# Altium schematic sheet MainBoard_V100_PSU_DET.SchDoc
size A4; SheetNumber: 5; SheetTotal: 22; Title_: Detector Power Supply
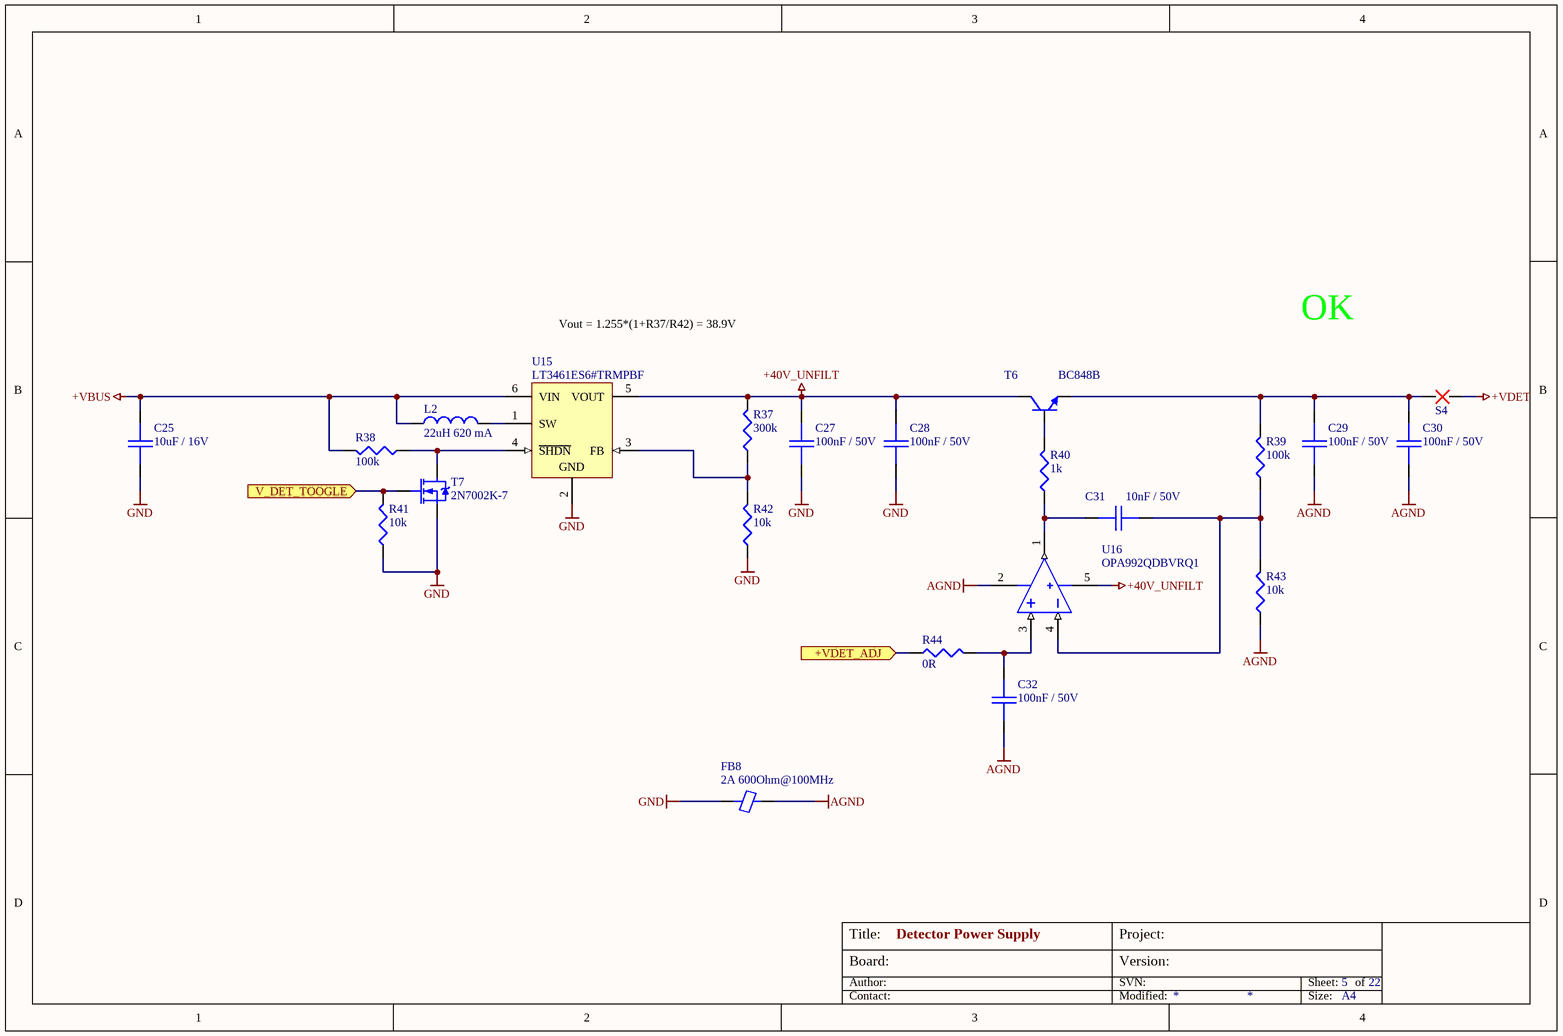
[diagram p0: MainBoard_V100_PSU_DET.SchDoc]

## Parts
C25  10uF / 16V  [0805_C]
C27  100nF / 50V  [0805_C]
C28  100nF / 50V  [0805_C]
C29  100nF / 50V  [0805_C]
C30  100nF / 50V  [0805_C]
C31  10nF / 50V  [0805_C]
C32  100nF / 50V  [0805_C]
FB8  2A 600Ohm@100MHz  [0805_FB]
L2  22uH 620 mA  [1210]
R37  300k  [0805]
R38  100k  [0805]
R39  100k  [0805]
R40  1k  [0805]
R41  10k  [0805]
R42  10k  [0805]
R43  10k  [0805]
R44  0R  [0805]
S4  SPLITER  [SPLITER2_30mil_9mil]  (value not drawn)  (no BOM)
T6  BC848B  [SOT-23]
T7  2N7002K-7  [SOT-23]
U15  LT3461ES6#TRMPBF  [SOT-23-6L]
U16  OPA992QDBVRQ1  [SOT-23-5]

## Ports
+VDET_ADJ (in), V_DET_TOOGLE (in)

## Nets
+40V_UNFILT: C27.1 C28.1 R37.2 T6.3(C) U15.5(VOUT) U16.5(V+)
+VBUS: C25.1 L2.1 R38.2 U15.6(VIN)
+VDET: S4.2
AGND: C29.2 C30.2 C32.1 FB8.2 R43.1 U16.2(V-)
GND: C25.2 C27.2 C28.2 FB8.1 R41.1 R42.1 T7.2(S) U15.2(GND)
+VDET_ADJ: R44.1 ; port +VDET_ADJ
V_DET_TOOGLE: R41.2 T7.1(G) ; port V_DET_TOOGLE
NetC29_1: C29.1 C30.1 R39.2 S4.1 T6.2(E)
NetC31_1: C31.1 R40.1 U16.1(OUT)
NetC31_2: C31.2 R39.1 R43.2 U16.4(IN-)
NetC32_2: C32.2 R44.2 U16.3(IN+)
NetL2_2: L2.2 U15.1(SW)
NetR37_1: R37.1 R42.2 U15.3(FB)
NetR38_1: R38.1 T7.3(D) U15.4(~{SHDN})
NetR40_2: R40.2 T6.1(B)

## Notes on the sheet
- Vout = 1.255*(1+R37/R42) = 38.9V
- OK
- Board:
- Author:
- Title:
- Project:
- SVN:
- Version:
- Sheet:
- of
- Contact:
- Modified:
- Size:
- A4

## Library data of the parts
C25 = 153: 10uF 16V X5R; Part Number: SMD0805-10uF-16V; Azonosító: 153; Category: Passives; Subcategory: PASS_Capacitor; Supplier 1: HESTORE; Supplier 1 order number: 100.344.52
C27-C30 C32 = 149: 100nF 50V X7R; Part Number: SMD0805-100nF-50V; Azonosító: 149; Category: Passives; Subcategory: PASS_Capacitor; Supplier 1: HESTORE; Supplier 1 order number: 100.011.22
C31 = 146: 10nF 50V X7R; Part Number: SMD0805-10nF-50V; Azonosító: 146; Category: Passives; Subcategory: PASS_Capacitor; Supplier 1: HESTORE; Supplier 1 order number: 100.011.24
FB8 = 183: Ferrite bead 2A 600Ohm@100MHz; Part Number: LCBB-601 SMD; Azonosító: 183; Category: Passives; Subcategory: PASS_Other; Supplier 1: HESTORE; Supplier 1 order number: 100.327.86
L2 = 387: 22uH 620 mA 1210; Part Number: CBC3225T220KR; Azonosító: 387; Category: Passives; Subcategory: PASS_Inductor; Supplier 1: MOUSER; Supplier 1 order number: 963-CBC3225T220KR; Help URL: https://hu.mouser.com/datasheet/2/396/wound02_e-2256580.pdf
R37 = 68: 300k 0805 0.125W 1%; Part Number: SMD0805-300k 1%; Azonosító: 68; Category: Passives; Subcategory: PASS_Resistor; Supplier 1: HESTORE; Supplier 1 order number: 100.437.89
R38 R39 = 66: 100k 0805 0.125W 5%; Part Number: SMD0805-100k 5%; Azonosító: 66; Category: Passives; Subcategory: PASS_Resistor; Supplier 1: HESTORE; Supplier 1 order number: 100.011.43
R40 = 52: 1k 0805 0.125W 1%; Part Number: SMD0805-1k 1%; Azonosító: 52; Category: Passives; Subcategory: PASS_Resistor; Supplier 1: HESTORE; Supplier 1 order number: 100.312.99
R41-R43 = 59: 10k 0805 0.125W 1%; Part Number: SMD0805-10k 1%; Azonosító: 59; Category: Passives; Subcategory: PASS_Resistor; Supplier 1: HESTORE; Supplier 1 order number: 100.403.38
R44 = 38: 0R 0805 0.125W 5%; Part Number: 0 R 5%; Azonosító: 38; Category: Passives; Subcategory: PASS_Resistor; Supplier 1: HESTORE; Supplier 1 order number: 100.275.70
S4 = 272: SPLITER2_30mil_9mil; Azonosító: 272; Part Number: SPLITER2_30mil_9mil; Category: Accessories; Subcategory: ACCE_Other
T6 = 309: Bipolar (BJT) Single Transistor, NPN, 30 V, 100 mA, 300 mW, SOT-23, Surface Mount; Azonosító: 309; Part Number: BC848B; Category: Semiconductors; Subcategory: SEMI_Transistor; Supplier 1: HESTORE; Supplier 1 order number: 100.209.08; Supplier 2: MOUSER; Supplier 2 order number: 637-BC848B; Help URL: https://hu.mouser.com/datasheet/2/849/bc846-3324195.pdf
T7 = 315: 2N7002K-7 Power MOSFET, N Channel, 60 V, 300 mA, 2 ohm, SOT-23, Surface Mount; Azonosító: 315; Part Number: 2N7002K-7; Category: Semiconductors; Subcategory: SEMI_FET; Supplier 1: HESTORE; Supplier 1 order number: 100.411.92; Supplier 2: MOUSER; Supplier 2 order number: 621-2N7002K-7; Help URL: https://hu.mouser.com/datasheet/2/115/DIOD_S_A0012992590_1-2543827.pdf
U15 = 328: 1.3 MHz Step-Up DC/DC Converter with Integrated Schottky, 6-pin SOT23 (S6-6), -40 to 85°C; Azonosító: 328; ComponentLink1Description: Datasheet; ComponentLink1URL: http://cds.linear.com/docs/en/datasheet/3461af.pdf; Part Number: LT3461ES6#TRMPBF; Category: Integrated Circuits; Subcategory: IC_Power; Supplier 1: MOUSER; Supplier 1 order number: 584-LT3461ES6#TRMPBF; Help URL: https://hu.mouser.com/datasheet/2/609/3461Afa-3123928.pdf
U16 = 358: OPA992-Q1 Automotive, 40-V Rail-to-Rail Input or Output,Low Offset Voltage, Low Noise Op Amp GBW 10.6MHz; Manufacturer_Name: Texas Instruments; Manufacturer_Part_Number: INA180A2IDBVR; Geometry.Height: 1.45mm; Azonosító: 358; Mouser Part Number: 595-INA180A2IDBVR; Mouser Price/Stock: https://www.mouser.co.uk/ProductDetail/Texas-Instruments/INA180A2IDBVR?qs=5aG0NVq1C4wYcJfa99BoHg%3D%3D; Datasheet Link: http://www.ti.com/lit/ds/symlink/ina180.pdf; Part Number: OPA992QDBVRQ1; Category: Integrated Circuits; Subcategory: IC_Analog; Supplier 1: MOUSER; Supplier 1 order number: 595-OPA992QDBVRQ1; Help URL: https://www.ti.com/general/docs/suppproductinfo.tsp?distId=26&gotoUrl=https://www.ti.com/lit/gpn/opa992-q1